# EAGLE design YosanoLoveButton (EAGLE 7.7.0)
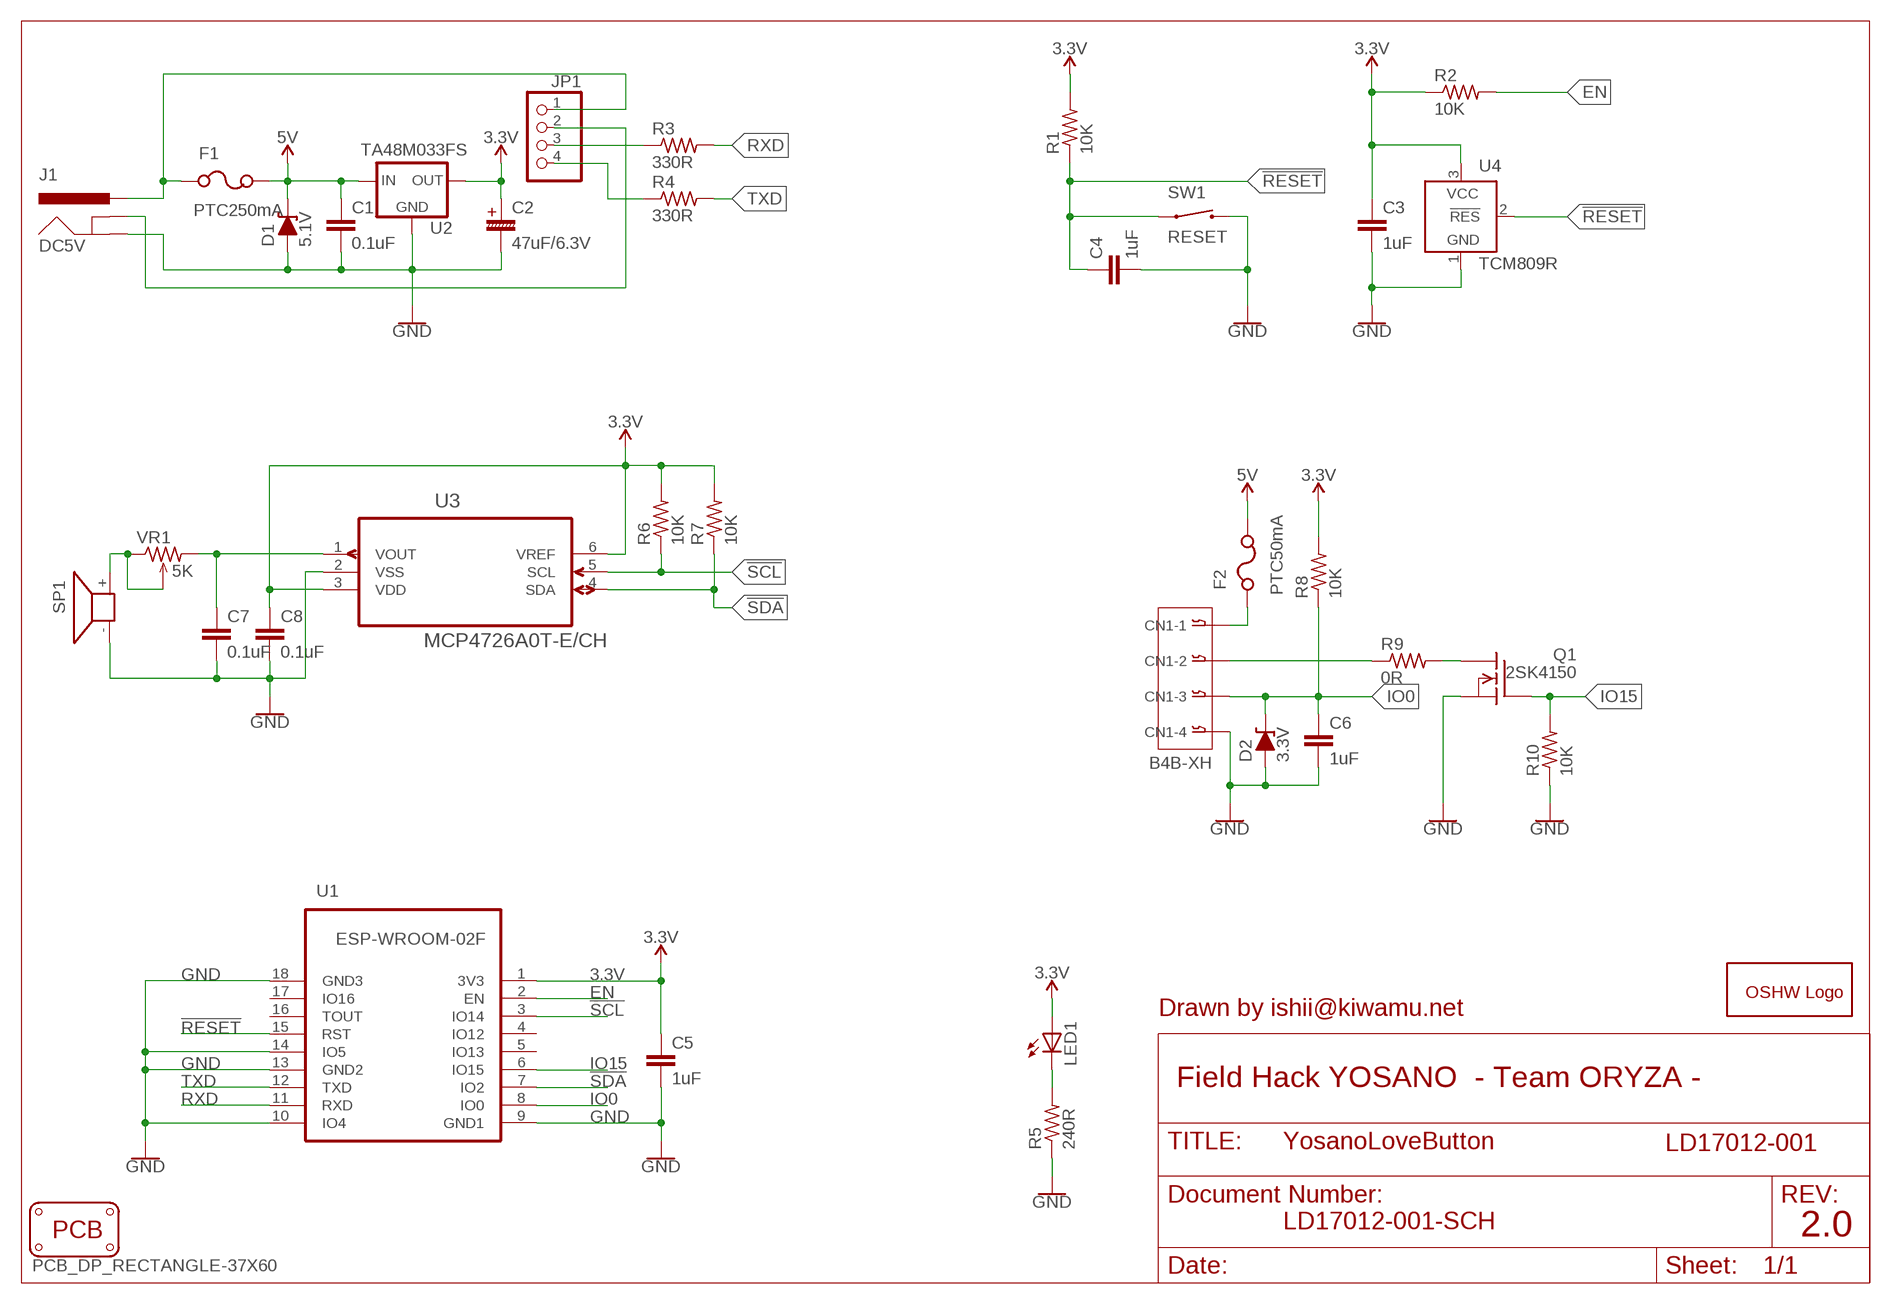
[diagram p0: schematic, sheet 1]

## Parts
C1  0.1uF  C5/2.5  [C5B2.5]
C2  47uF/6.3V  C-PR-2,0X5  [E2,0-5]
C3  1uF  C5/2.5  [C5B2.5]
C4  1uF  C5/2.5  [C5B2.5]
C5  1uF  C5/2.5  [C5B2.5]
C6  1uF  C5/2.5  [C5B2.5]
C7  0.1uF  C5/2.5  [C5B2.5]
C8  0.1uF  C5/2.5  [C5B2.5]
CN1  B4B-XH  04-JST-B4B-XH-A  [B4B-XH]
D1  5.1V  ZENER-DIODEZD-5LD  [ZDIO-5-LD]
D2  3.3V  ZENER-DIODEZD-5LD  [ZDIO-5-LD]
F1  PTC250mA  PTCPTH  [PTC-PTH]
F2  PTC50mA  PTCPTH  [PTC-PTH]
GOLD_ORB_SM1  OSHWLOGOLOGO5MM  [OSHW_5MM]
J1  DC5V  POWER_JACK  [POWER_JACK_PTH]
JP1  PINHD-1X4  [1X04]
LED1  LED3MM  [LED3MM]
PCB1  PCB_DP_RECTANGLE-37X60  [DP6037_V1]
Q1  2SK4150  [TO92]
R1  10K  R-US_0204/5  [0204/5]
R2  10K  R-US_0204/5  [0204/5]
R3  330R  R-US_0204/5  [0204/5]
R4  330R  R-US_0204/5  [0204/5]
R5  240R  R-US_0204/5  [0204/5]
R6  10K  R-US_0204/5  [0204/5]
R7  10K  R-US_0204/5  [0204/5]
R8  10K  R-US_0204/5  [0204/5]
R9  0R  R-US_0204/5  [0204/5]
R10  10K  R-US_0204/5  [0204/5]
SP1  PKM13EPYH4000  [PKM13EPYH4000]
SW1  RESET  TVBP06  [TVBP06]
U1  ESP-WROOM-02F  [FRONT-FACE]
U2  TA48M033FS  [HSIP3]
U3  MCP4726A0T-E/CH  [SOT95P270X145-6N]
U4  TCM809R  TCM809  [SOT23B-3]
VR1  5K  3362P  [3362P]

## Nets
3.3V [pwr]: C2.+ C3.1 C5.1 C8.1 LED1.A R1.2 R2.1 R6.2 R7.2 R8.2 U1.1(3V3) U2.P$2(OUT) U3.3(VDD) U3.6(VREF) U4.3(VCC)
5V [pwr]: C1.1 D1.C F1.2 F2.2 U2.P$1(IN)
!RESET: C4.1 R1.1 SW1.1 U1.15(RST) U4.2(!RES)
!SCL: R6.1 U1.3(IO14) U3.5(SCL)
!SDA: R7.1 U1.7(IO2) U3.4(SDA)
EN: R2.2 U1.2(EN)
GND [gnd]: C1.2 C2.- C3.2 C4.2 C5.2 C6.2 C7.2 C8.2 CN1.P$4 D1.A D2.A J1.GND Q1.1(S) R5.1 R10.1 SP1.- SW1.2 U1.9(GND1) U1.10(IO4) U1.13(GND2) U1.14(IO5) U1.18(GND3) U2.P$3(GND) U3.2(VSS) U4.1(GND)
IO0: C6.1 CN1.P$3 D2.C R8.1 U1.8(IO0)
IO15: Q1.2(G) R10.2 U1.6(IO15)
N$1 [pwr]: F1.1 J1.PWR JP1.1
N$2: LED1.K(C) R5.2
N$3: JP1.4 R4.1
N$4: C7.1 U3.1(VOUT) VR1.3
N$5: JP1.3 R3.1
N$6: SP1.+ VR1.1 VR1.2
N$14 [gnd]: J1.GNDBREAK JP1.2
N$15: Q1.3(D) R9.2
N$18 [pwr]: CN1.P$1 F2.1
N$19: CN1.P$2 R9.1
RXD: R3.2 U1.11(RXD)
TXD: R4.2 U1.12(TXD)
Unconnected: U1.4(IO12) U1.5(IO13) U1.16(TOUT) U1.17(IO16)

## Notes on the sheet
- Drawn by ishii@kiwamu.net
- Field Hack YOSANO  - Team ORYZA -
- LD17012-001
- LD17012-001-SCH
- 2.0

## Library data of the parts
C1 C7 C8 = YosanoLoveButton:C: CAPACITOR naming: grid - package width; MF: 株式会社村田製作所(muRata); MPN: RDER72E104K2K1H03B; OC_AKIZUKI: P-10147
C2 = YosanoLoveButton:C-PR: POLARIZED ELECTROLYTIC/TANTALUM; MF: 東信工業; MPN: 0JUTCX470M; OC_SENGOKU: 6548-54KH
C3-C6 = YosanoLoveButton:C: CAPACITOR naming: grid - package width; MF: 株式会社村田製作所(muRata); MPN: RDER71H105K2K1H03B; OC_AKIZUKI: P-08150
CN1 = YosanoLoveButton:04-JST: JST CONNECTOR; MF: 日本圧着端子製造(JST); MPN: B4B-XH-A(LF)(SN); OC_SENGOKU: 5AL6-8BMK
D1 = YosanoLoveButton:ZENER-DIODE: Z-Diode; MF: PANJIT; MPN: GDZJ5.1B; OC_AKIZUKI: I-07493
D2 = YosanoLoveButton:ZENER-DIODE: Z-Diode; MF: PANJIT; MPN: GDZJ3.3B; OC_AKIZUKI: I-07491
F1 = YosanoLoveButton:PTC: Resettable Fuse PTC Resettable Fuse. Spark Fun Electronics SKU : COM-08357; MF: Tyco Electronics Corporation; MPN: RXEF005; OC_AKIZUKI: P-01354
F2 = YosanoLoveButton:PTC: Resettable Fuse PTC Resettable Fuse. Spark Fun Electronics SKU : COM-08357; MF: Tyco Electronics Corporation; MPN: RXEF005; OC_AKIZUKI: P-01352
GOLD_ORB_SM1 = YosanoLoveButton:OSHWLOGO: The OSHW logo for PCB layout
J1 = YosanoLoveButton:POWER_JACK: Power Jack Connector This is the standard 5.5mm barrel jack for power. The PTH is the most common, proven, reliable, footprint. The Slot footprint only works if the mill layer is transmitted to the PCB fab house so be warned. Here are the connectors we sell at SparkFun: DC Barrel Power Jack/Connector <https://www.sparkfun.com/products/119> (PRT-00119) DC Barrel Power Jack/Connector (SMD) <https://www.sparkfun.com/products/12748> (PRT-12748) DC Barrel Jack Adapter - Breadboard Compatible <https://www.sparkfun.com/products/10811> (PRT-10811) It is used on this SparkFun product (and many, many others): SparkFun RedBoard - Programmed with Arduino <https://www.sparkfun.com/products/12757> (DEV-12757) Also, if you need a mating power supply or connector, please check these out: Wall Adapter Power Supply - 9VDC 650mA <https://www.sparkfun.com/products/298> (TOL-00298) DC Barrel Jack Adapter - Male <https://www.sparkfun.com/products/10287> (PRT-10287); MF: マル信無線電機株式会社; MPN: MJ-179P; OC_AKIZUKI: C-00077
JP1 = YosanoLoveButton:PINHD-1X4: PIN HEADER; MF: Useconn Electronics Ltd.; MPN: PHA-1x4SG; OC_AKIZUKI: C-04392
LED1 = YosanoLoveButton:LED: LED OSRAM: - CHIPLED LG R971, LG N971, LY N971, LG Q971, LY Q971, LO R971, LY R971 LH N974, LH R974 LS Q976, LO Q976, LY Q976 LO Q996 - Hyper CHIPLED LW Q18S LB Q993, LB Q99A, LB R99A - SideLED LS A670, LO A670, LY A670, LG A670, LP A670 LB A673, LV A673, LT A673, LW A673 LH A674 LY A675 LS A676, LA A676, LO A676, LY A676, LW A676 LS A679, LY A679, LG A679 - Hyper Micro SIDELED® LS Y876, LA Y876, LO Y876, LY Y876 LT Y87S - SmartLED LW L88C, LW L88S LB L89C, LB L89S, LG L890 LS L89K, LO L89K, LY L89K LS L896, LA L896, LO L896, LY L896 - TOPLED LS T670, LO T670, LY T670, LG T670, LP T670 LSG T670, LSP T670, LSY T670, LOP T670, LYG T670 LG T671, LOG T671, LSG T671 LB T673, LV T673, LT T673, LW T673 LH T674 LS T676, LA T676, LO T676, LY T676, LB T676, LH T676, LSB T676, LW T676 LB T67C, LV T67C, LT T67C, LS T67K, LO T67K, LY T67K, LW E67C LS E67B, LA E67B, LO E67B, LY E67B, LB E67C, LV E67C, LT E67C LW T67C LS T679, LY T679, LG T679 LS T770, LO T770, LY T770, LG T770, LP T770 LB T773, LV T773, LT T773, LW T773 LH T774 LS E675, LA E675, LY E675, LS T675 LS T776, LA T776, LO T776, LY T776, LB T776 LHGB T686 LT T68C, LB T68C - Hyper Mini TOPLED® LB M676 - Mini TOPLED Santana® LG M470 LS M47K, LO M47K, LY M47K Source: http://www.osram.convergy.de/; COLOR: Red; MF: OptoSupply; MPN: OSR5JA3Z74A; OC_AKIZUKI: I-11577
PCB1 = dp_pcb:PCB_DP_RECTANGLE: Dangerous Prototypes Standard Rectangular PCB sizes
Q1 = YosanoLoveButton:2SK4150: Silicon N Channel MOS FET High Speed Power Switching 250V; 0.4A; TO-92; MF: RENESAS; MPN: 2SK4150TZ-E; OC_AKIZUKI: I-09027; PACKAGE: TO-92
R1 R2 R6-R8 R10 = YosanoLoveButton:R-US_: RESISTOR, American symbol; COLOR: 茶黒橙金; MF: タクマン; MPN: RD25SJ10K; OC_SENGOKU: 6AJS-7UJ6
R3 = YosanoLoveButton:R-US_: RESISTOR, American symbol; COLOR: 橙橙茶金; MF: タクマン; MPN: RD25SJ330R; OC_SENGOKU: 8A8S-7UJV
R4 = YosanoLoveButton:R-US_: RESISTOR, American symbol; COLOR: 橙橙茶金; MF: タクマン; MPN: RD25SJ300R; OC_SENGOKU: 8A8S-7UJV
R5 = YosanoLoveButton:R-US_: RESISTOR, American symbol; COLOR: 赤黄茶金; MF: タクマン; MPN: RD25SJ 240R; OC_SENGOKU: 2A8S-6UJM
R9 = YosanoLoveButton:R-US_: RESISTOR, American symbol; COLOR: 黒; MF: タクマン; MPN: RD25SP 0R; OC_SENGOKU: 3ATS-7FJM
SP1 = YosanoLoveButton:PKM13EPYH4000: SPEAKER Source: Schukat; MF: muRata; MPN: PKM13EPYH4000; OC_AKIZUKI: P-04118
SW1 = YosanoLoveButton:TVBP06: 2pin switch. http://akizukidenshi.com/catalog/g/gP-08074/; COLOR: 黒; MF: Zhejiang Jianfu Electronics Co., Ltd; MPN: TVBP06-B043CB-B; OC_AKIZUKI: P-08073
U1 = YosanoLoveButton:ESP-WROOM-02: WiFi module - ESP-WROOM-02; MF: Espressif; MPN: ESP-WROOM-02; OC_AKIZUKI: M-9607; OC_SENGOKU: EEHD-4SH8; OC_SWITCHSCIENCE: 2346
U2 = YosanoLoveButton:TA48M*: TA48 series; MF: 株式会社東芝セミコンダクター社(TOSHIBA); MPN: TA48M033F(S Q); OC_AKIZUKI: I-00538; PACKAGE: HSIP3
U3 = YosanoLoveButton:MCP4726A0T-E/CH: 12-Bit Digital-to-Analog Converter with EEPROM; MF: Microchip; MPN: MCP4725A0T-E/CH; OC_AKIZUKI: I-07611; PACKAGE: SOT-23-6
U4 = YosanoLoveButton:TCM809: POWER SUPPLY MONITOR replacement for Maxim MAX809 and MAX810; MF: MICROCHIP; MPN: TCM809MENB713; OC_FARNELL: 9762744; OC_NEWARK: 96K3998
VR1 = YosanoLoveButton:3362: 3362 Series 1/4" Square Trimmer; MF: bourns

## Net classes
0 default: width 0.406 mm, drill 0.305 mm, clearance 0.254 mm
1 gnd: width 0.61 mm, drill 0.61 mm, clearance 0.305 mm
2 pwr: width 0.559 mm, drill 0.559 mm, clearance 0.305 mm

## Board
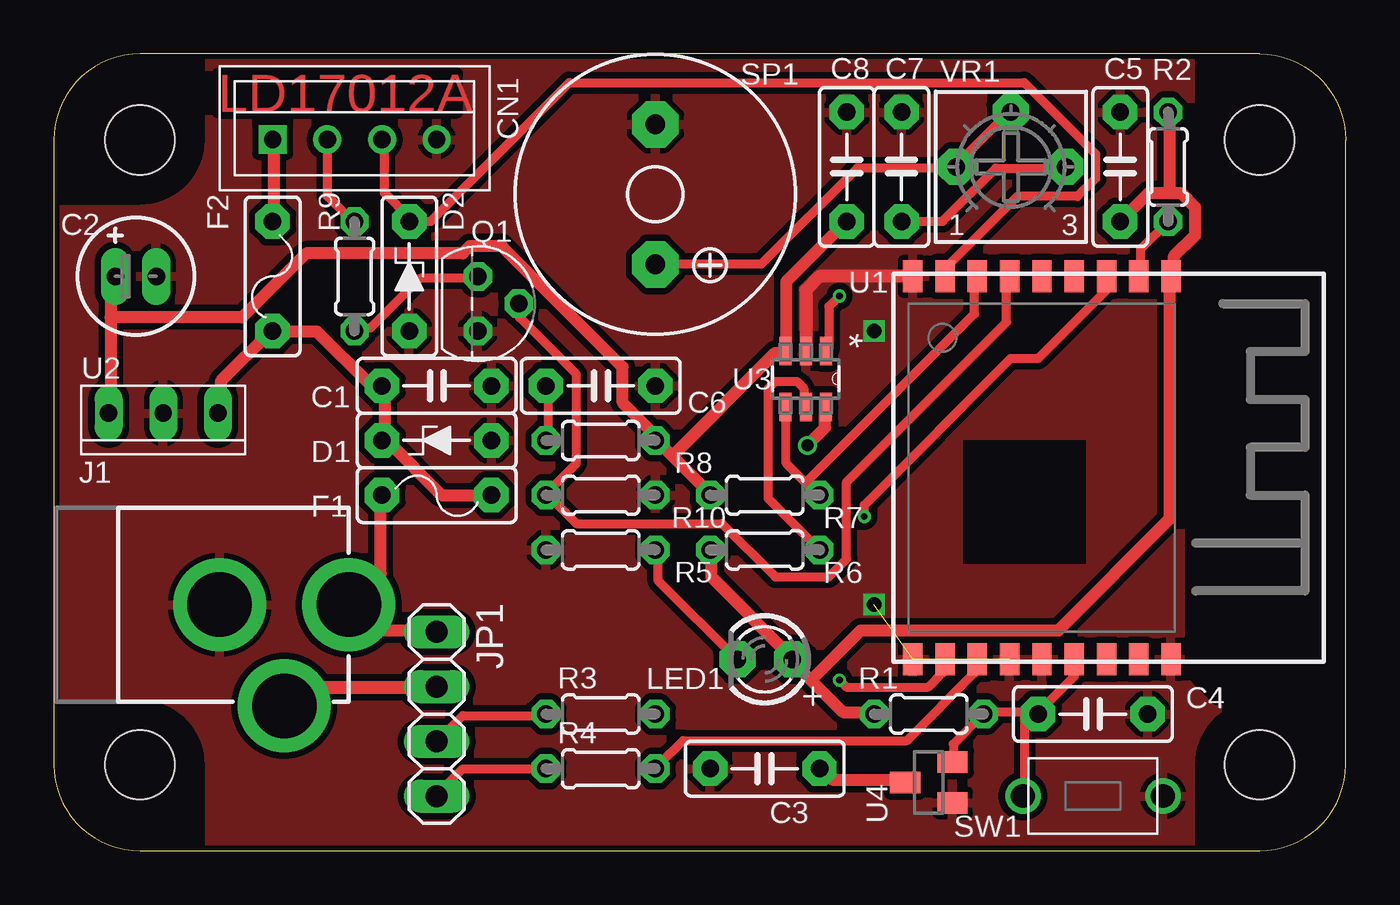
[diagram p1: board, top side]
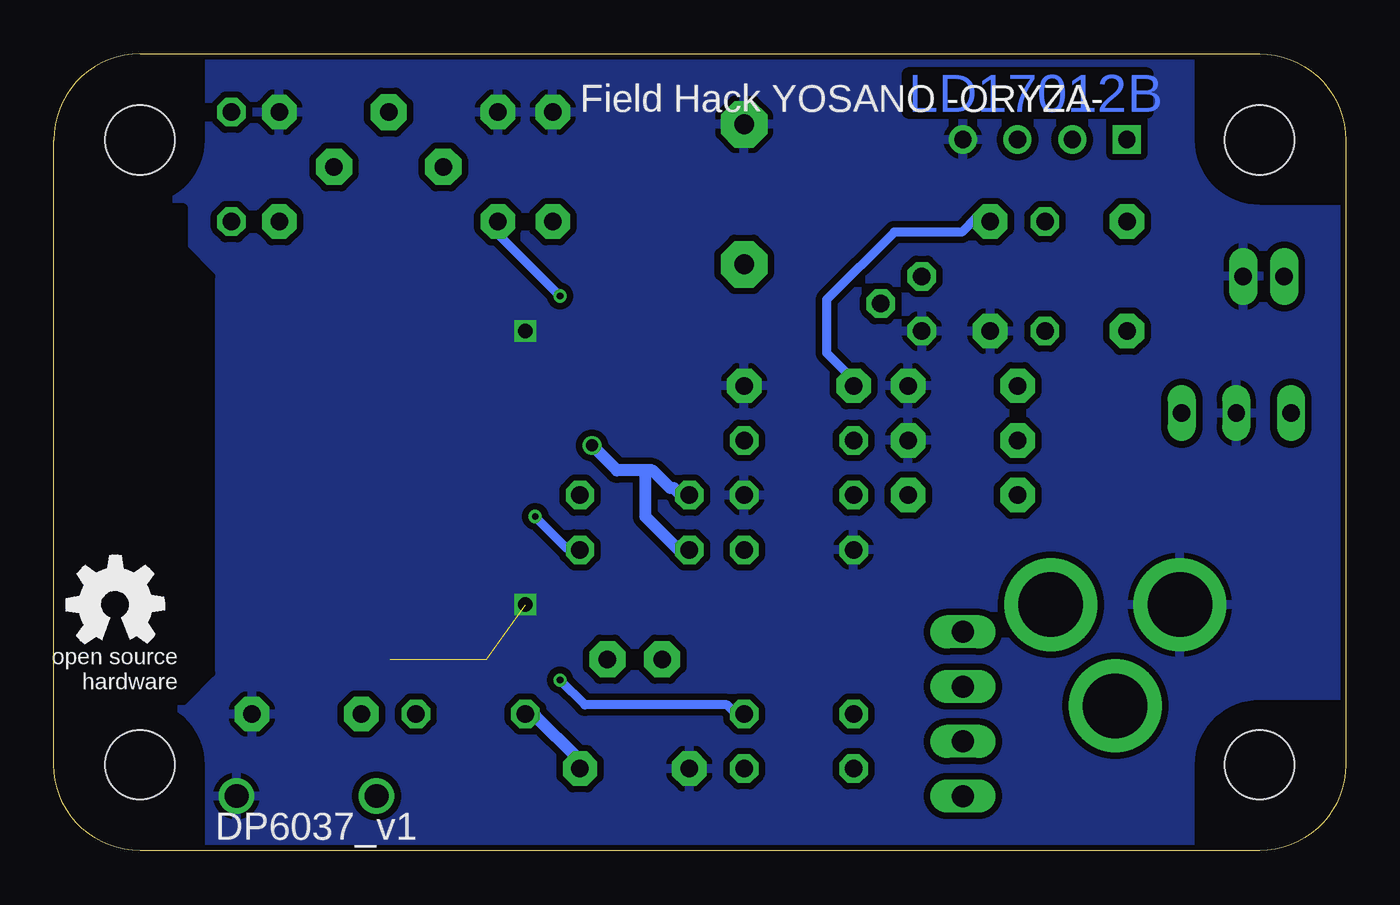
[diagram p2: board, bottom side, seen from below]

Size 60 x 37 mm. Coordinates in mm from the lower left corner, seen from the top.
Copper layers (1*16): Top 0.035mm / dielectric 1.5mm / Bottom 0.035mm
Design rules "SeeedStudio_2layer_DRU_no_angle_20140221": minimum track width 6mil, minimum drill 12mil, track to track 6mil, track to pad 6mil, pad to pad 6mil, via to via 6mil, smd to smd 0mil, copper to edge 10mil, drill to drill 10mil, minimum pad ring 10mil, minimum via ring 6mil, stop-mask expansion 2mil, vias tented up to drill 100mil, thermal gap 10mil
tRestrict: area 52.7,7 to 59.7,29.8
bRestrict: area 52.7,7 to 59.7,29.8

### Footprints (pad centres in the part's own frame; a part is rotated, then mirrored left to right if it is on the bottom)
C5B2.5 = drill 0.813 pad 1.6 octagon: 1 -2.54,0; 2 2.54,0
E2,0-5 = drill 0.813 long: + -0.953,0; - 0.953,0
B4B-XH = drill 0.8 square: P$1 -3.81,0 | drill 0.8: P$2 -1.27,0; P$3 1.27,0; P$4 3.81,0
ZDIO-5-LD = drill 0.813 pad 1.6 octagon: A 2.54,0; C -2.54,0
PTC-PTH = drill 0.813 pad 1.6 octagon: 1 -2.54,0; 2 2.54,0
POWER_JACK_PTH = drill 2.997 pad 4.318: GND 0,7.7; GNDBREAK 4.7,10.7; PWR 0,13.7
1X04 = drill 1.016 long: 1 -3.81,0; 2 -1.27,0; 3 1.27,0; 4 3.81,0
LED3MM = drill 0.813 pad 1.676 octagon: A -1.27,0; K 1.27,0
DP6037_V1 = hole 3.2: 4,4; 56,4; 56,33; 4,33
TO92 = drill 0.813 octagon: 1 1.27,0; 2 0,1.905; 3 -1.27,0
0204/5 = drill 0.813 octagon: 1 -2.54,0; 2 2.54,0
PKM13EPYH4000 = drill 0.914 pad 2.159 octagon: + 3.251,0; - -3.251,0
TVBP06 = drill 1.1: 1 -3.25,0; 2 3.25,0
FRONT-FACE = smd 1.485 x 0.9: 1 -8.893,4.9; 2 -8.893,3.4; 3 -8.893,1.9; 4 -8.893,0.4; 5 -8.893,-1.1; 6 -8.893,-2.6; 7 -8.893,-4.1; 8 -8.893,-5.6; 9 -8.893,-7.1; 10 8.893,-7.1; 11 8.893,-5.6; 12 8.893,-4.1; 13 8.893,-2.6; 14 8.893,-1.1; 15 8.893,0.4; 16 8.893,1.9; 17 8.893,3.4; 18 8.893,4.9
HSIP3 = drill 0.8 long: P$1 -2.54,0; P$2 2.54,0; P$3 0,0
SOT95P270X145-6N = smd 1.321 x 0.559: 1 -1.295,0.94; 2 -1.295,0; 3 -1.295,-0.94; 4 1.295,-0.94; 5 1.295,0; 6 1.295,0.94
SOT23B-3 = smd 1 x 1.4: 1 -0.95,-1.1; 2 0.95,-1.1; 3 0,1.1
3362P = drill 0.813 pad 1.676 octagon: 1 -2.54,0; 2 0,2.54; 3 2.54,0

### Placement (x,y rotation side)
C1  17.78,21.59 0 top
C2  3.81,26.67 0 top
C3  33.02,3.81 180 top
C4  48.26,6.35 0 top
C5  49.53,31.75 90 top
C6  25.4,21.59 0 top
C7  39.37,31.75 90 top
C8  36.83,31.75 90 top
CN1  13.97,33.02 0 top
D1  17.78,19.05 0 top
D2  16.51,26.67 270 top
F1  17.78,16.51 0 top
F2  10.16,26.67 270 top
GOLD_ORB_SM1  57.15,11.43 0 bottom
J1  0,11.43 270 top
JP1  17.78,6.35 270 top
LED1  33.02,8.89 180 top
PCB1  0,0 0 top
Q1  19.68,25.4 270 top
R1  40.64,6.35 180 top
R2  51.75,31.75 270 top
R3  25.4,6.35 0 top
R4  25.4,3.81 0 top
R5  25.4,13.97 0 top
R6  33.02,13.97 180 top
R7  33.02,16.51 180 top
R8  25.4,19.05 0 top
R9  13.97,26.67 270 top
R10  25.4,16.51 180 top
SP1  27.94,30.48 270 top
SW1  48.26,2.54 0 top
U1  46.99,17.78 270 top
U2  5.08,20.32 180 top
U3  34.92,21.91 270 top
U4  40.64,3.17 90 top
VR1  44.45,31.75 0 top

### Tracks (layer width: path | path; a pad name or v marks a point on that pad's centre or on a via)
3.3V  (via drill 0.56)
  Top 0.559: C8.1 36.82,29.22 34.01,26.42 34.01,23.28 U3.3 33.85,23.11 33.52,23.11 28.73,18.33 | 2.64,24.77 2.64,26.42 2.81,26.58 C2.+ | 2.64,24.77 2.64,20.47 U2.P$2 | v35,18.82 35.83,19.65 35.83,20.47 U3.6 | 28.73,18.33 30.54,16.51 R7.2 | 28.73,18.33 28.07,18.99 R8.2 27.9,19.32 26.42,20.8 26.42,22.45 20.8,28.07 19.32,28.07 18.99,27.74 11.72,27.74 8.75,24.77 2.64,24.77 | 51.84,30.54 50.85,30.54 49.53,29.22 C5.1 | 51.84,30.54 52.34,30.54 53,29.88 53,28.56 52.01,27.57 52.01,26.75 U1.1 51.84,26.42 51.84,15.4 46.67,10.24 37.48,10.24 35.17,7.92 | 51.84,30.54 51.84,34.18 R2.1 | U4.3 39.46,3.3 36.16,3.3 35.66,3.8 C3.1 | 35.17,7.92 34.34,8.75 LED1.A 34.18,9.08 30.54,12.71 30.54,13.87 R6.2 | 35.17,7.92 36.65,6.44 37.97,6.44 R1.2
  Bottom 0.559: v35,18.82 33.85,17.67 32.52,17.67 | 32.52,17.67 32.19,17.67 31.37,16.84 31.2,16.84 30.87,16.51 R7.2 | C3.1 35.66,3.96 35.66,4.29 37.64,6.27 37.97,6.27 R1.2 | 32.52,17.67 32.52,15.52 30.87,13.87 30.54,13.87 R6.2
5V
  Top 0.559: U2.P$1 7.76,20.47 7.76,21.79 10.07,24.11 F2.2 10.4,24.11 12.22,24.11 14.69,21.63 15.02,21.63 C1.1 15.35,21.46 15.35,19.15 D1.C 15.52,18.99 18,16.51 F1.2
!RESET
  Top 0.406: U4.2 41.77,4.13 41.77,4.95 43.09,6.27 R1.1 43.26,6.44 45.57,6.44 C4.1 | U1.15 47.38,8.75 47.38,8.09 45.73,6.44 C4.1 | SW1.1 45.07,2.64 45.07,6.27 C4.1
!SCL  (via drill 0.3)
  Top 0.406: R6.1 33.19,16.34 33.19,21.46 33.52,21.79 34.51,21.79 34.84,21.46 34.84,20.64 U3.5 | v37.64,15.52 37.64,16.05 44.45,22.86 45.09,22.86 45.4,22.86 45.72,22.86 48.9,26.04 U1.3
  Bottom 0.406: v37.64,15.52 36.16,14.03 35.66,14.03 R6.1
!SDA
  Top 0.406: 34.92,17.09 35.5,16.51 R7.1 | 34.92,17.09 34.01,18 34.01,20.47 U3.4 | 34.92,17.09 42.76,24.93 42.76,26.58 U1.7
EN
  Top 0.406: 50.48,26.67 50.48,26.75 | 50.48,26.75 50.48,27.94 R2.2 | U1.2 50.35,26.75 50.48,26.75
GND  (via drill 0.66)  (2 unrouted)
  Top 0.61: 34.92,23.5 34.92,26.04 35.56,26.67 40.01,26.67 U1.9
  other vias: 38.1,11.43 38.1,24.13
  pour Bottom: 0,36.83 59.69,36.83 59.69,0 0,0
  pour Top: 0,36.83 59.69,36.83 59.69,0 0,0
IO0
  Top 0.406: R8.1 22.95,19.15 22.95,21.46 C6.1 | U1.8 41.44,26.75 41.44,27.08 44.74,30.38 47.55,30.38 48.37,31.2 48.37,32.36 45.07,35.66 23.94,35.66 17.5,29.22 16.51,29.22 D2.C 16.51,29.39 15.35,30.54 15.35,33.02 CN1.P$3
  Bottom 0.406: C6.1 22.95,21.63 22.95,21.96 24.11,23.11 24.11,25.59 20.97,28.73 17.83,28.73 17.17,29.39 16.68,29.39 16.51,29.22 D2.C
IO15
  Top 0.406: U1.6 44.25,26.58 44.25,24.55 36.82,17.12 36.82,13.54 35.99,12.71 33.52,12.71 31.04,15.19 24.27,15.19 22.95,16.51 R10.2 22.95,16.68 24.27,18 24.27,22.12 21.63,24.77 21.63,25.26 Q1.2
N$1
  Top 0.559: JP1.1 17.67,10.24 14.86,10.24 13.7,11.39 J1.PWR 13.87,11.56 15.19,12.88 15.19,16.51 F1.1
N$2
  Top 0.406: R5.2 28.07,13.87 28.07,12.55 31.7,8.91 LED1.K
N$3
  Top 0.406: R4.1 22.78,3.8 18.99,3.8 17.83,2.64 JP1.4
N$4  (via drill 0.3)
  Top 0.406: v36.49,25.76 35.99,25.26 35.99,23.28 U3.1 | VR1.3 46.89,31.7 43.75,31.7 41.27,29.22 39.46,29.22 C7.1
  Bottom 0.406: v36.49,25.76 39.29,28.56 39.29,29.06 C7.1
N$5
  Top 0.406: R3.1 22.78,6.27 18.99,6.27 17.83,5.12 JP1.3
N$6
  Top 0.406: VR1.2 44.41,34.34 41.94,31.86 VR1.1 41.77,31.7 37.31,31.7 32.85,27.24 28.07,27.24 SP1.+
N$14
  Top 0.61: JP1.2 17.67,7.59 11.56,7.59 10.73,6.77 J1.GNDBREAK
N$15
  Top 0.406: R9.2 14.03,24.27 14.69,24.27 17,26.58 19.65,26.58 Q1.3
N$18
  Top 0.559: CN1.P$1 10.24,33.02 10.24,29.22 F2.1
N$19
  Top 0.406: CN1.P$2 12.71,33.02 12.71,30.38 13.87,29.22 R9.1
RXD  (via drill 0.3)
  Top 0.406: v36.49,7.92 36.82,7.59 40.62,7.59 41.27,8.26 41.27,8.75 U1.11
  Bottom 0.406: v36.49,7.92 35.33,6.77 28.73,6.77 28.4,6.44 28.07,6.44 R3.2
TXD
  Top 0.406: U1.12 42.76,8.75 42.76,8.26 39.62,5.12 29.22,5.12 28.07,3.96 R4.2

### Text on the board
Top: LD17012A
Bottom: LD17012B
bNames: Field Hack YOSANO -ORYZA-